# Altium schematic sheet Ctrol1,Ctrol2.SchDoc
size A4
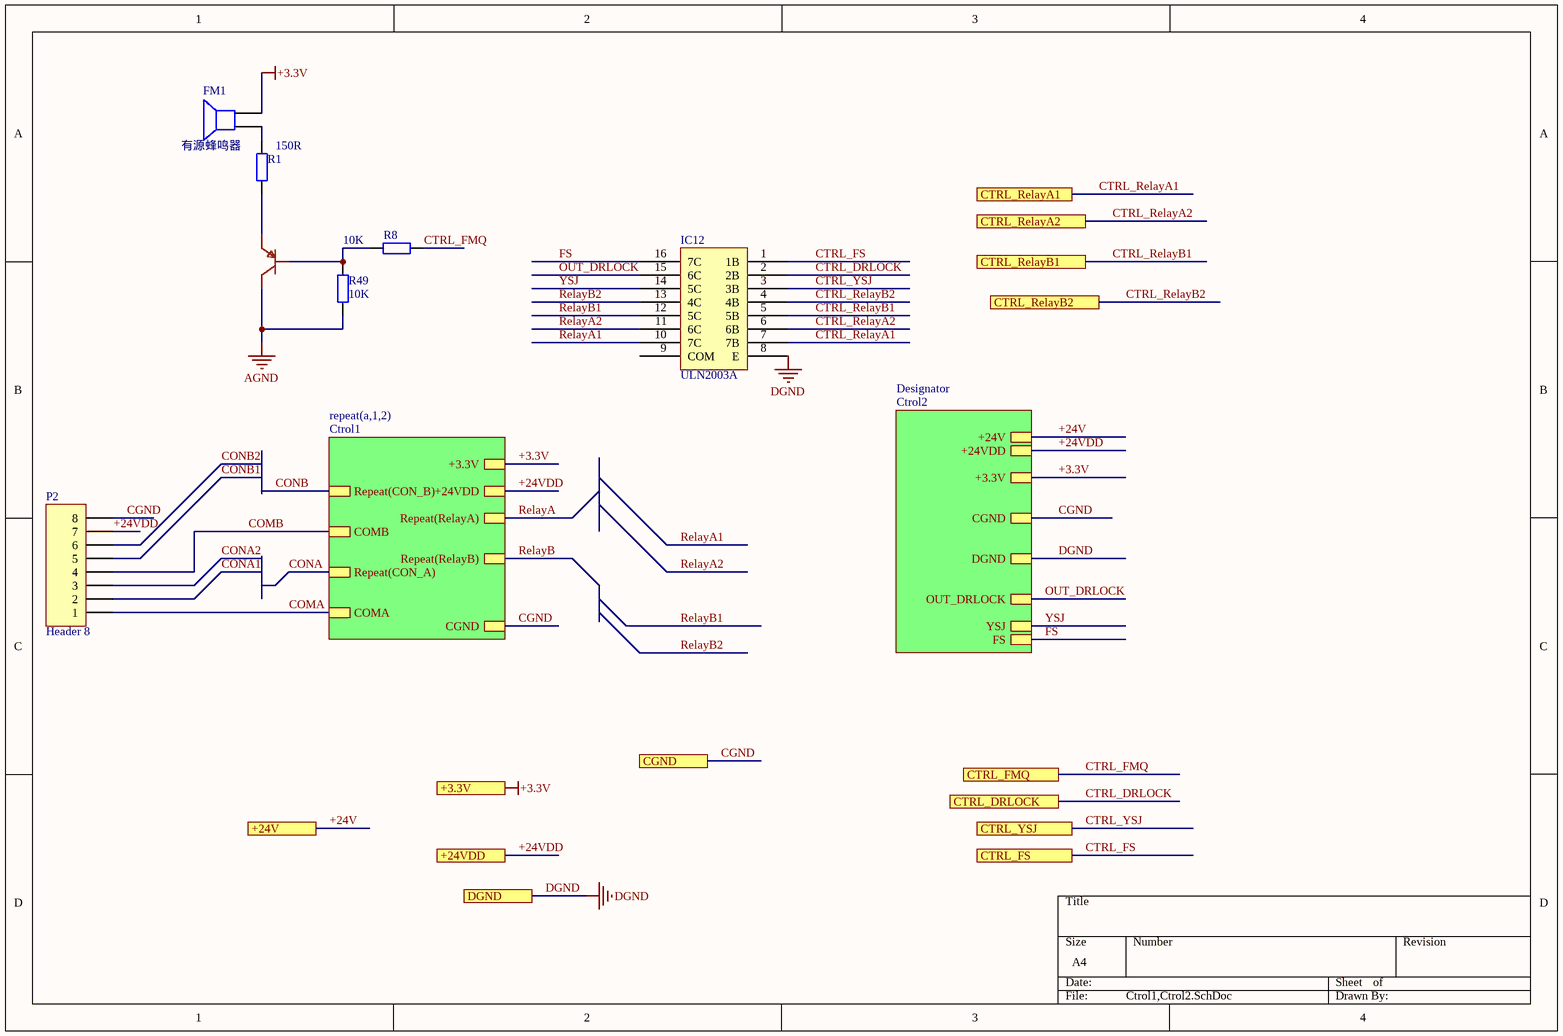
[diagram p0: Ctrol1,Ctrol2.SchDoc]

## Parts
FM1  有源蜂鸣器  [SPK]
IC12  ULN2003A  [SO16]
P2  Header 8  [CONN-TH-KF7.62-8p]
Q3  SS8550  [SOT23]  (value not drawn)
R1  150R  [0805R]
R8  10K  [0805R]
R49  10K  [0805R]

## Sub-sheets
Designator = Ctrol2: +24V, +3.3V, CGND, DGND, OUT_DRLOCK, YSJ, FS, +24VDD
repeat(a,1,2) = Ctrol1: +3.3V, +24VDD, Repeat(RelayA), Repeat(RelayB), CGND, COMA, Repeat(CON_A), COMB, Repeat(CON_B)

## Ports
+3.3V, +24V, +24VDD, CGND, CTRL_DRLOCK, CTRL_FMQ, CTRL_FS, CTRL_RelayA1, CTRL_RelayA2, CTRL_RelayB1, CTRL_RelayB2, CTRL_YSJ, DGND

## Nets
+3.3V: FM1.2 ; port +3.3V, sheet repeat(a,1,2)/+3.3V, sheet Designator/+3.3V
AGND: Q3.3(C) R49.2
DGND: IC12.8(E) ; port DGND, sheet Designator/DGND
+24V: port +24V, sheet Designator/+24V
+24VDD: P2.7 ; port +24VDD, sheet repeat(a,1,2)/+24VDD, sheet Designator/+24VDD
CGND: P2.8 ; port CGND, sheet repeat(a,1,2)/CGND, sheet Designator/CGND
COMA: P2.1 ; sheet repeat(a,1,2)/COMA
COMB: P2.4 ; sheet repeat(a,1,2)/COMB
CONA: sheet repeat(a,1,2)/Repeat(CON_A)
CONA1: P2.2
CONA2: P2.3
CONB: sheet repeat(a,1,2)/Repeat(CON_B)
CONB1: P2.5
CONB2: P2.6
CTRL_DRLOCK: IC12.2(2B) ; port CTRL_DRLOCK
CTRL_FMQ: R8.2 ; port CTRL_FMQ
CTRL_FS: IC12.1(1B) ; port CTRL_FS
CTRL_RelayA1: IC12.7(7B) ; port CTRL_RelayA1
CTRL_RelayA2: IC12.6(6B) ; port CTRL_RelayA2
CTRL_RelayB1: IC12.5(5B) ; port CTRL_RelayB1
CTRL_RelayB2: IC12.4(4B) ; port CTRL_RelayB2
CTRL_YSJ: IC12.3(3B) ; port CTRL_YSJ
FS: IC12.16(7C) ; sheet Designator/FS
OUT_DRLOCK: IC12.15(6C) ; sheet Designator/OUT_DRLOCK
RelayA: sheet repeat(a,1,2)/Repeat(RelayA)
RelayA1: IC12.10(7C)
RelayA2: IC12.11(6C)
RelayB: sheet repeat(a,1,2)/Repeat(RelayB)
RelayB1: IC12.12(5C)
RelayB2: IC12.13(4C)
YSJ: IC12.14(5C) ; sheet Designator/YSJ
NetFM1_1: FM1.1 R1.2
NetQ3_1: Q3.1(B) R8.1 R49.1
NetQ3_2: Q3.2(E) R1.1

Not connected (* = marked no-connect by the designer): IC12 9(COM)

## Library data of the parts
FM1 = Speaker: 直径φ12*9.5mm 3V 3.3V 电磁式有源一体蜂鸣器 电磁蜂鸣器 有源蜂鸣器 直径φ12*9.5mm 华能蜂鸣器 / 品牌名称 / 华能 / 商品型号 / TMB12A03 / 商品编号 / C96222 / 商品封装 / 插件,D=12mm; value: 3.3V 12*9.5; Published: *; Manufacturer: *
IC12 = ULN2003
P2 = Header 8: DG141V-2.54-8; LatestRevisionDate: 17-Jul-2002; LatestRevisionNote: Re-released for DXP Platform.; Publisher: Altium Limited
Q3 = SS8550_C7420371: 牌: CJ(江苏长电/长晶) / 封装: SOT-23 / 描述: hfe=200~350 / 晶体管类型: PNP / 集电极电流(Ic): 1.5A / 集射极击穿电压(Vceo): 25V / 耗散功率(Pd): 300mW / 类目: 三极管(BJT) / 编号: C8542; Manufacturer: 宏迦橙; Add into BOM: yes; DC Current Gain (hFE@Ic,Vce): 120@100mA,1.0V; Transition Frequency (fT): 100MHz; Collector Cut-Off Current (Icbo): 100nA; Collector-Emitter Saturation Voltage (VCE(sat)@Ic,Ib): 500mV@800mA,80mA; Symbol: SS8550_C7420371; Device: SS8550_C7420371; LCSC Part Name: 耐压:25V 电流:1.5A PNP H档 200-350; Supplier Part: C7420371; Manufacturer Part: SS8550; Supplier Footprint: SOT-23; JLCPCB Part Class: Extended Part; Datasheet: https://atta.szlcsc.com/upload/public/pdf/source/20231222/5BDA6DBF3A79C59009F81F0EEE6F8969.pdf; Supplier: LCSC; Convert to PCB: yes; Transistor Type: PNP; Collector Current (Ic): 1.5A; Collector-Emitter Breakdown Voltage (Vceo): 25V; Power Dissipation (Pd): 300mW; Operating Temperature: -55℃~+150℃
R1 = Res2: Resistor; Value: 10K; Published: 8-Jun-2000; LatestRevisionDate: 17-Jul-2002; LatestRevisionNote: Re-released for DXP Platform.; PackageReference: AXIAL-0.4; Publisher: Altium Limited; PackageDescription: Axial Device, Thru-Hole; 2 Leads; 0.4 in Pin Spacing
R8 R49 = Res2: Resistor; Published: 8-Jun-2000; LatestRevisionDate: 17-Jul-2002; LatestRevisionNote: Re-released for DXP Platform.; PackageReference: AXIAL-0.4; Publisher: Altium Limited; PackageDescription: Axial Device, Thru-Hole; 2 Leads; 0.4 in Pin Spacing; Value: 10K